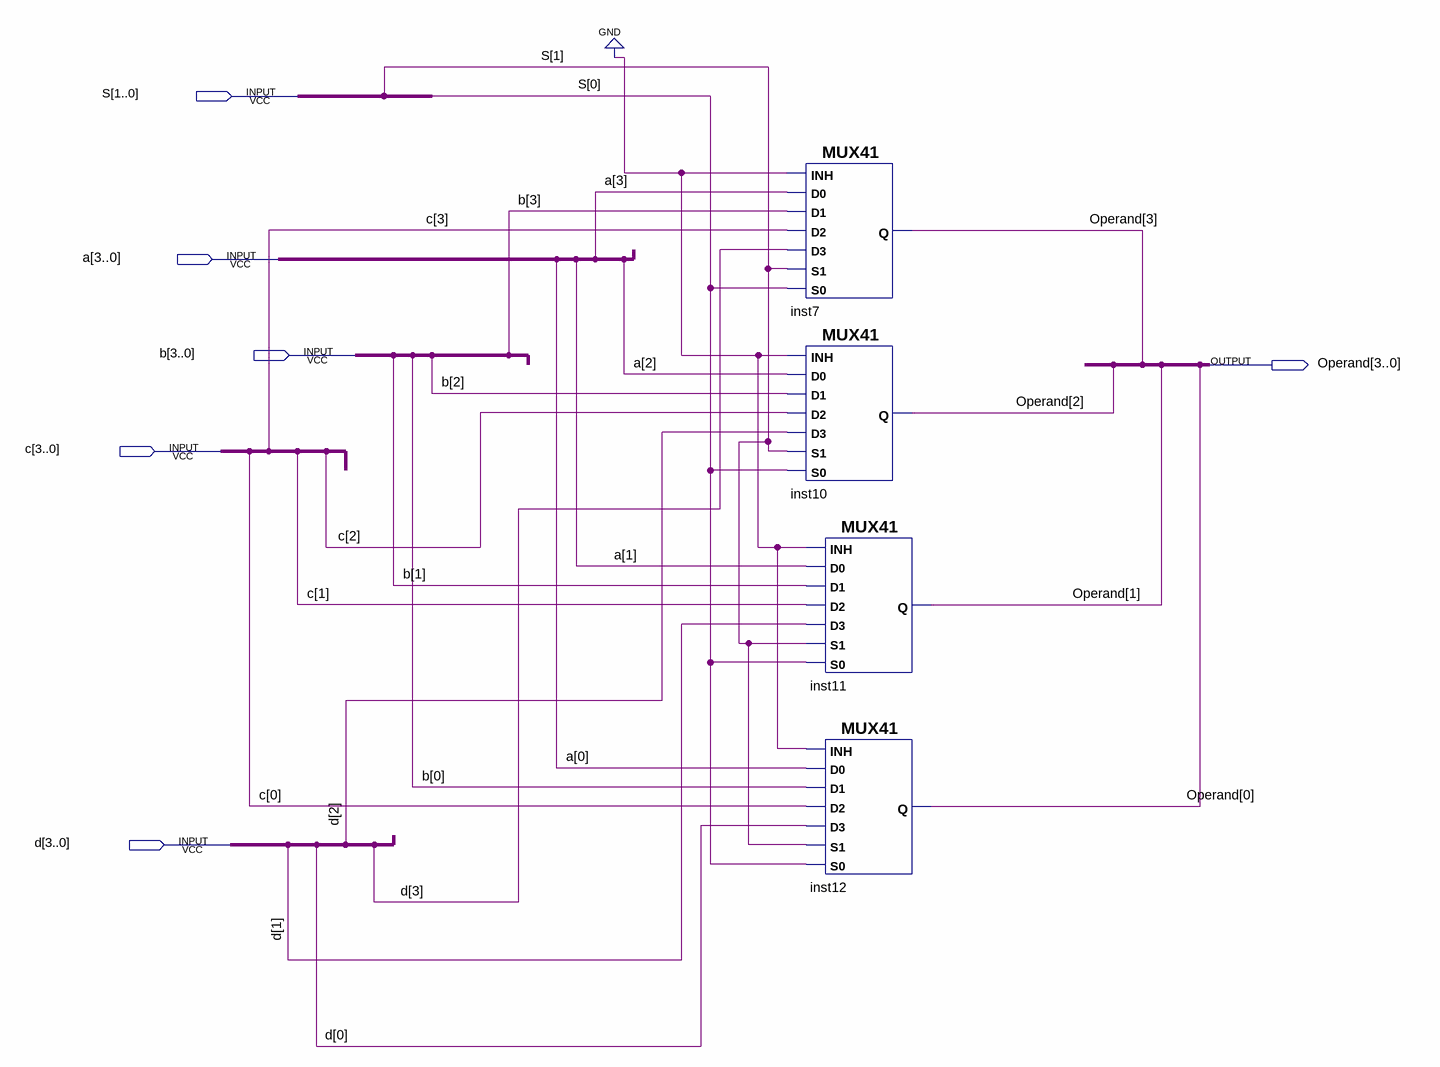
[diagram p0: schematic sheet]
// Quartus schematic mux4.bdf as structural Verilog: 4 symbols, 6 pins
module mux4 (
  input  [1:0] S,
  input  [3:0] a,
  input  [3:0] b,
  input  [3:0] c,
  input  [3:0] d,
  output [3:0] Operand
);

  MUX41 inst7 (.S0(S[0]), .D2(c[3]), .S1(S[1]), .D3(d[3]), .D0(a[3]), .INH(1'b0), .D1(b[3]), .Q(Operand[3]));
  MUX41 inst10 (.S0(S[0]), .D2(c[2]), .S1(S[1]), .D3(d[2]), .D0(a[2]), .INH(1'b0), .D1(b[2]), .Q(Operand[2]));
  MUX41 inst11 (.S0(S[0]), .D2(c[1]), .S1(S[1]), .D3(d[1]), .D0(a[1]), .INH(1'b0), .D1(b[1]), .Q(Operand[1]));
  MUX41 inst12 (.S0(S[0]), .D2(c[0]), .S1(S[1]), .D3(d[0]), .D0(a[0]), .INH(1'b0), .D1(b[0]), .Q(Operand[0]));
endmodule
